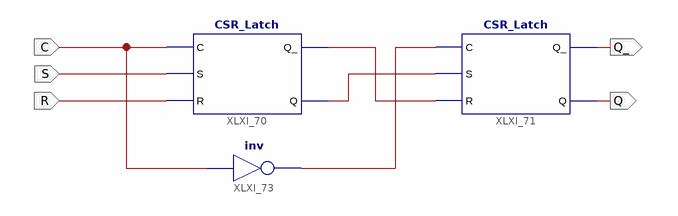
[diagram p0: schematic sheet 1]
// Xilinx ISE schematic MS_Flipflop.sch (kintex7) as structural Verilog: 3 symbols, 5 ports
module MS_Flipflop (
  input  S,
  input  R,
  input  C,
  output Q_,
  output Q
);

  wire XLXN_165, XLXN_168, XLXN_170;

  CSR_Latch XLXI_70 (.C(C), .S(S), .R(R), .Q_(XLXN_170), .Q(XLXN_168));
  CSR_Latch XLXI_71 (.C(XLXN_165), .S(XLXN_168), .R(XLXN_170), .Q_(Q_), .Q(Q));
  not XLXI_73 (XLXN_165, C);
endmodule
